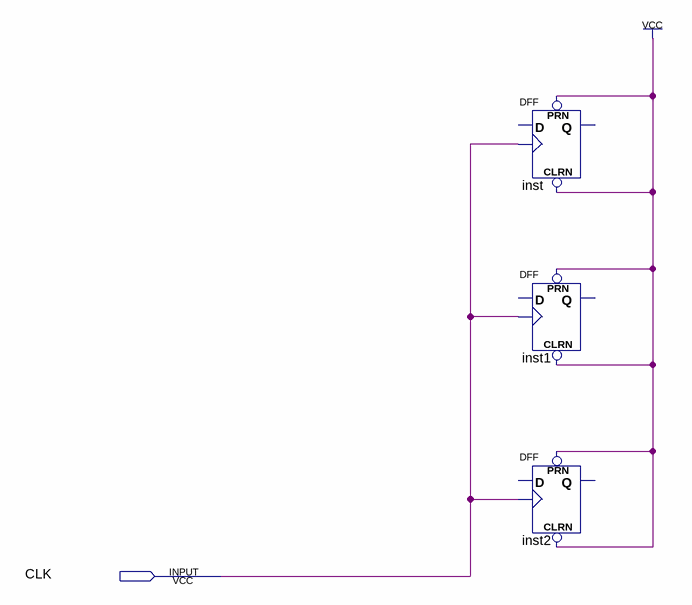
[diagram p0: schematic sheet]
// Quartus schematic initFSM.bdf as structural Verilog: 3 symbols, 1 pins
module initFSM (
  input  CLK
);

  DFF inst (.CLRN(1'b1), .CLK(CLK), .PRN(1'b1));  // open: D, Q
  DFF inst1 (.CLRN(1'b1), .CLK(CLK), .PRN(1'b1));  // open: D, Q
  DFF inst2 (.CLRN(1'b1), .CLK(CLK), .PRN(1'b1));  // open: D, Q
endmodule
